# Altium schematic sheet Power_Line_3V3.SchDoc: PDM
size A3; SheetNumber: 2; SheetTotal: 6
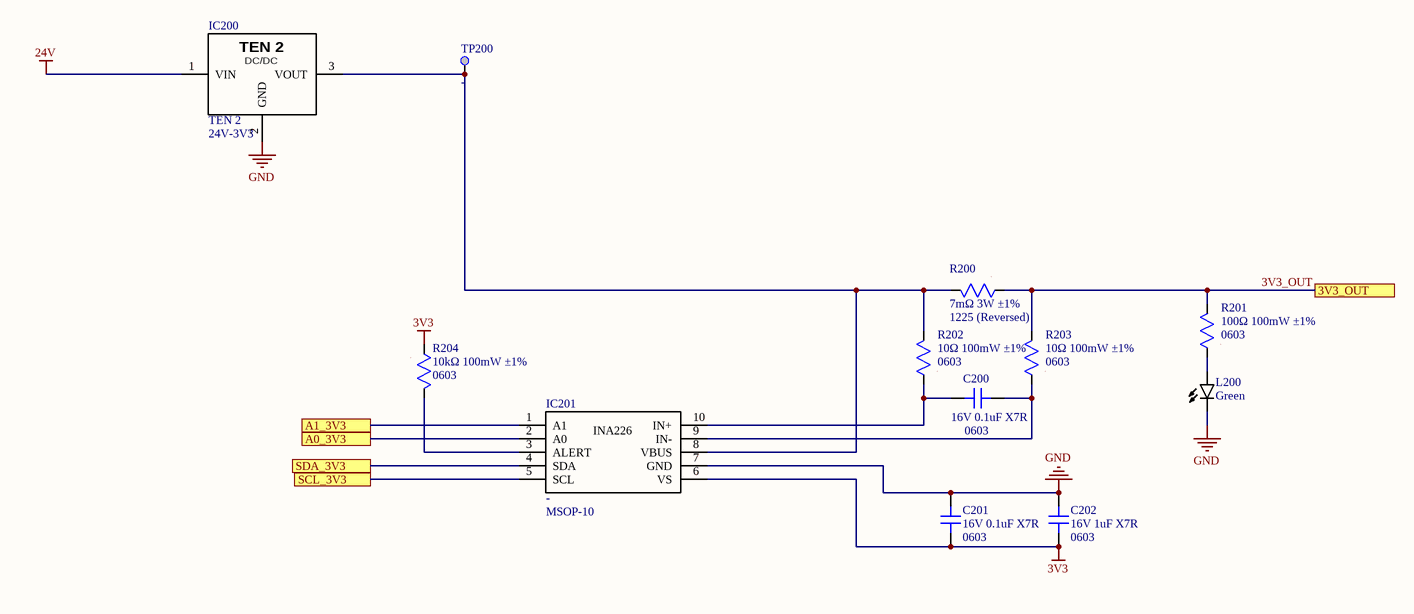
[diagram p0: Power_Line_3V3.SchDoc]

## Parts
C200  value 16V 0.1uF X7R  Package: 0603  [CAP SMD 0603]  (hidden comment: CAP non polarized)
C201  value 16V 0.1uF X7R  Package: 0603  [CAP SMD 0603]  (hidden comment: CAP non polarized)
C202  value 16V 1uF X7R  Package: 0603  [CAP SMD 0603]  (hidden comment: CAP non polarized)
IC200  TEN 2  value 24V-3V3  [TEN 2]
IC201  Package: MSOP-10  [VSOP-10]  (hidden comment: INA226)
L200  value Green  [LED SMD 0603]  (hidden comment: LED WHITE)
R200  value 7mΩ 3W ±1%  Package: 1225 (Reversed)  [RES SMD 1225 Reversed]  (hidden comment: RES)
R201  value 100Ω 100mW ±1%  Package: 0603  [RES SMD 0603]  (hidden comment: RES)
R202  value 10Ω 100mW ±1%  Package: 0603  [RES SMD 0603]  (hidden comment: RES)
R203  value 10Ω 100mW ±1%  Package: 0603  [RES SMD 0603]  (hidden comment: RES)
R204  value 10kΩ 100mW ±1%  Package: 0603  [RES SMD 0603]  (hidden comment: RES)
TP200  Test Point  [TP_SMD_1MM]  (value not drawn)  (no BOM)

## Ports
3V3_OUT, A0_3V3, A1_3V3, SCL_3V3, SDA_3V3

## Nets
3V3: C201.2 C202.2 IC201.6(VS) R204.1
24V: IC200.1(VIN)
GND: C201.1 C202.1 IC200.2(GND) IC201.7(GND) L200.C
3V3_OUT: R200.1 R201.2 R203.2 ; port 3V3_OUT
A0_3V3: IC201.2(A0) ; port A0_3V3
A1_3V3: IC201.1(A1) ; port A1_3V3
SCL_3V3: IC201.5(SCL) ; port SCL_3V3
SDA_3V3: IC201.4(SDA) ; port SDA_3V3
NetC200_1: C200.1 IC201.10(IN+) R202.1
NetC200_2: C200.2 IC201.9(IN-) R203.1
NetIC200_3: IC200.3(VOUT) IC201.8(VBUS) R200.2 R202.2 TP200.1
NetIC201_3: IC201.3(ALERT) R204.2
NetL200_A: L200.A R201.1

## Notes on the sheet
- Project:
- Subsystem:
- Company:
- Document:
- Author:
- Revision:
- Date:
- Sheet:
- /
- (in symbol 070-0001) DC/DC

## Library data of the parts
C200 C201 = 001-0112: Condensadores de cerámica multicapa (MLCC- SMD/SMT) WCAP-CSGP 0.1uF 0603 10% 16V MLCC; MPN: 885012206046; Manufacturer: Wurth Elektronik; ComponentLink1Description: Datasheet; ComponentLink1URL: https://www.we-online.com/components/products/datasheet/885012206046.pdf; ComponentLink2Description: Distributor Link; ComponentLink2URL: https://www.mouser.es/ProductDetail/Wurth-Elektronik/885012206046?qs=0KOYDY2FL2%252B89gr6HvTBXA%3D%3D; ID: 001-0112; Distributor PN: 710-885012206046; Distributor: Mouser
C202 = 001-0110: Condensadores de cerámica multicapa (MLCC- SMD/SMT) WCAP-CSGP 1uF 0603 10% 16V MLCC; MPN: 885012206052; Manufacturer: Wurth Elektronik; ComponentLink1Description: Datasheet; ComponentLink1URL: https://www.we-online.com/components/products/datasheet/885012206052.pdf; ComponentLink2Description: Distributor Link; ComponentLink2URL: https://www.mouser.es/ProductDetail/Wurth-Elektronik/885012206052?qs=0KOYDY2FL2%2F2JKabApojcQ%3D%3D; ID: 001-0110; Distributor PN: 710-885012206052; Distributor: Mouser
IC200 = 070-0001: Convertidores DC/DC para montaje pasante 4.75-36Vin 3.3V 2A switching regulator; MPN: TSR 2-2433; Manufacturer: TRACO Power; ComponentLink1Description: Datasheet; ComponentLink1URL: https://www.tracopower.com/tsr2-datasheet; ComponentLink2Description: Distributor Link; ComponentLink2URL: https://www.mouser.es/ProductDetail/TRACO-Power/TSR-2-2433?qs=NtE2QagKf6Qer8edccxn%2FA%3D%3D; ID: 070-0001; Package: 14.0x7.5x10.1mm; Distributor PN: 495-TSR2-2433; Distributor: Mouser
IC201 = 050-0001: Monitores y reguladores de corriente y energía Hi-Side Msmt Bi-Dir Current/Pwr Mon A 59 A 595-INA226AIDGST; MPN: INA226AIDGSR; Manufacturer: 595-INA226AIDGSR; ComponentLink1Description: Datasheet; ComponentLink1URL: https://www.ti.com/lit/ds/symlink/ina226.pdf?ts=1772078114731&ref_url=https%253A%252F%252Fwww.ti.com%252Fproduct%252FINA226; ComponentLink2Description: Distributor Link; ComponentLink2URL: https://www.mouser.es/ProductDetail/Texas-Instruments/INA226AIDGSR?qs=tQG3bEuiOZD4quG3egR36g%3D%3D&srsltid=AfmBOopOjh8KVXQVeHwZlO8DxeOetC6-xgaoNkKslHEV4iGJ_SkIIo7K; ID: 050-0001; Value: -; Distributor PN: Texas Instruments; Distributor: Mouser
L200 = 033-0023: LED de un solo color Green 525nm 1400mcd 2.85V 73deg 0603; MPN: VLMTG1400-GS08; Manufacturer: Vishay Semiconductors; ComponentLink1Description: Datasheet; ComponentLink1URL: https://www.vishay.com/docs/84393/vlmtg1400.pdf; ComponentLink2Description: Distributor Link; ComponentLink2URL: https://www.mouser.es/ProductDetail/Vishay-Semiconductors/VLMTG1400-GS08?qs=gt1LBUVyoHlZ6yHd8iEIzQ%3D%3D; ID: 033-0023; Package: 0603; Distributor PN: 78-VLMTG1400-GS08; Distributor: Mouser
R200 = 015-0003: Resistores de detección de corriente - SMD 3W 0.007ohm 1% 50ppm; MPN: KRL6432E-M-R007-F-T1; Manufacturer: Susumu; ComponentLink1Description: Datasheet; ComponentLink1URL: https://www.mouser.es/datasheet/3/826/1/n_catalog_partition19_en.pdf; ComponentLink2Description: Distributor Link; ComponentLink2URL: https://www.mouser.es/ProductDetail/Susumu/KRL6432E-M-R007-F-T1?qs=FG09h9tFCuA5fgBuyupdEw%3D%3D; ID: 015-0003; Distributor PN: 754-KRL6432EMR007FT1; Distributor: Mouser
R201 = 010-0172: Thick Film Resistors WRIS-RSKS 100 Ohms 1 % 0.1 W 0603 AEC-Q200; MPN: 560112116009; Manufacturer: Wurth Elektronik; ComponentLink1Description: Datasheet; ComponentLink1URL: https://www.we-online.com/components/products/datasheet/560112116009.pdf; ComponentLink2Description: Distributor Link; ComponentLink2URL: https://www.mouser.es/ProductDetail/Wurth-Elektronik/560112116009?qs=sGAEpiMZZMvdGkrng054txLI%2FDB4oIKDTCqaE%2Fpesdwv2JWXHdCmlQ%3D%3D; ID: 010-0172; Distributor PN: 710-560112116009; Distributor: Mouser
R202 R203 = 010-0149: Resistores de película gruesa - SMD WRIS-RSKS 10 Ohms 1 % 0.1 W 0603 AEC-Q200; MPN: 560112116013; Manufacturer: Wurth Elektronik; ComponentLink1Description: Datasheet; ComponentLink1URL: https://www.we-online.com/components/products/datasheet/560112116013.pdf; ComponentLink2Description: Distributor Link; ComponentLink2URL: https://www.mouser.es/ProductDetail/Wurth-Elektronik/560112116013?qs=mELouGlnn3f7quibYlpocQ%3D%3D; ID: 010-0149; Distributor PN: 710-560112116013; Distributor: Mouser
R204 = 010-0145: Resistores de película gruesa - SMD WRIS-RSKS 10 kOhms 1 % 0.1 W 0603 AEC-Q200; MPN: 560112116005; Manufacturer: Wurth Elektronik; ComponentLink1Description: Datasheet; ComponentLink1URL: https://www.we-online.com/components/products/datasheet/560112116005.pdf; ComponentLink2Description: Distributor Link; ComponentLink2URL: https://www.mouser.es/ProductDetail/Wurth-Elektronik/560112116005?qs=mELouGlnn3dMVSPHwBGouA%3D%3D; ID: 010-0145; Distributor PN: 710-560112116005; Distributor: Mouser
TP200 = 110-0007: ComponentLink1URL: -; ComponentLink1Description: Datasheet; ComponentLink1URL: *; ComponentLink2Description: Distributor Link; ComponentLink2URL: -; ID: 110-0007; Value: -; Package: -; MPN: -; Manufacturer: -; Distributor PN: -; Distributor: -